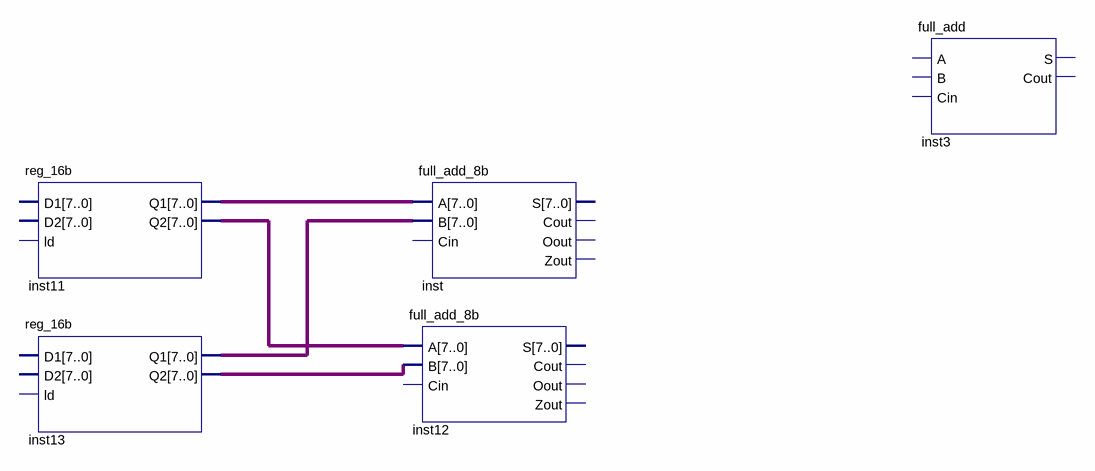
[diagram p0: schematic sheet]
// Quartus schematic projekt.bdf as structural Verilog: 5 symbols, 0 pins
module projekt (
);

  wire [7:0] inst11_q1, inst11_q2, inst13_q1, inst13_q2;

  reg_16b inst11 (.Q1(inst11_q1), .Q2(inst11_q2));  // open: D1, D2, ld
  reg_16b inst13 (.Q1(inst13_q1), .Q2(inst13_q2));  // open: D1, D2, ld
  full_add_8b inst (.A(inst11_q1), .B(inst13_q1));  // open: Cin, S, Cout, Oout, Zout
  full_add_8b inst12 (.A(inst11_q2), .B(inst13_q2));  // open: Cin, S, Cout, Oout, Zout
  full_add inst3 ();  // open: A, B, Cin, S, Cout
endmodule
